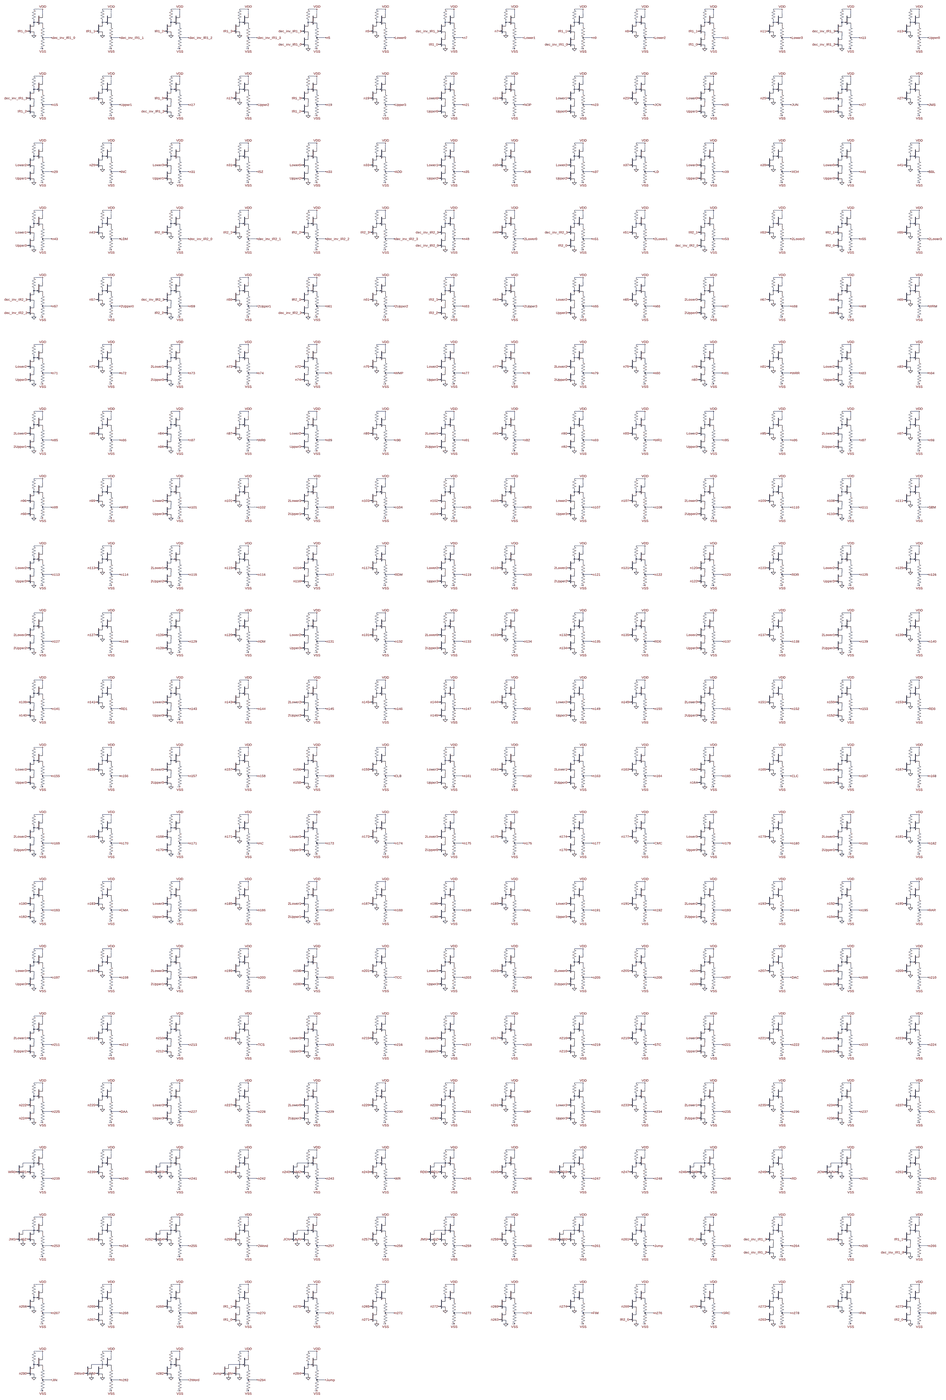
[diagram p0: schematic instruction_decoder.asc, whole sheet]
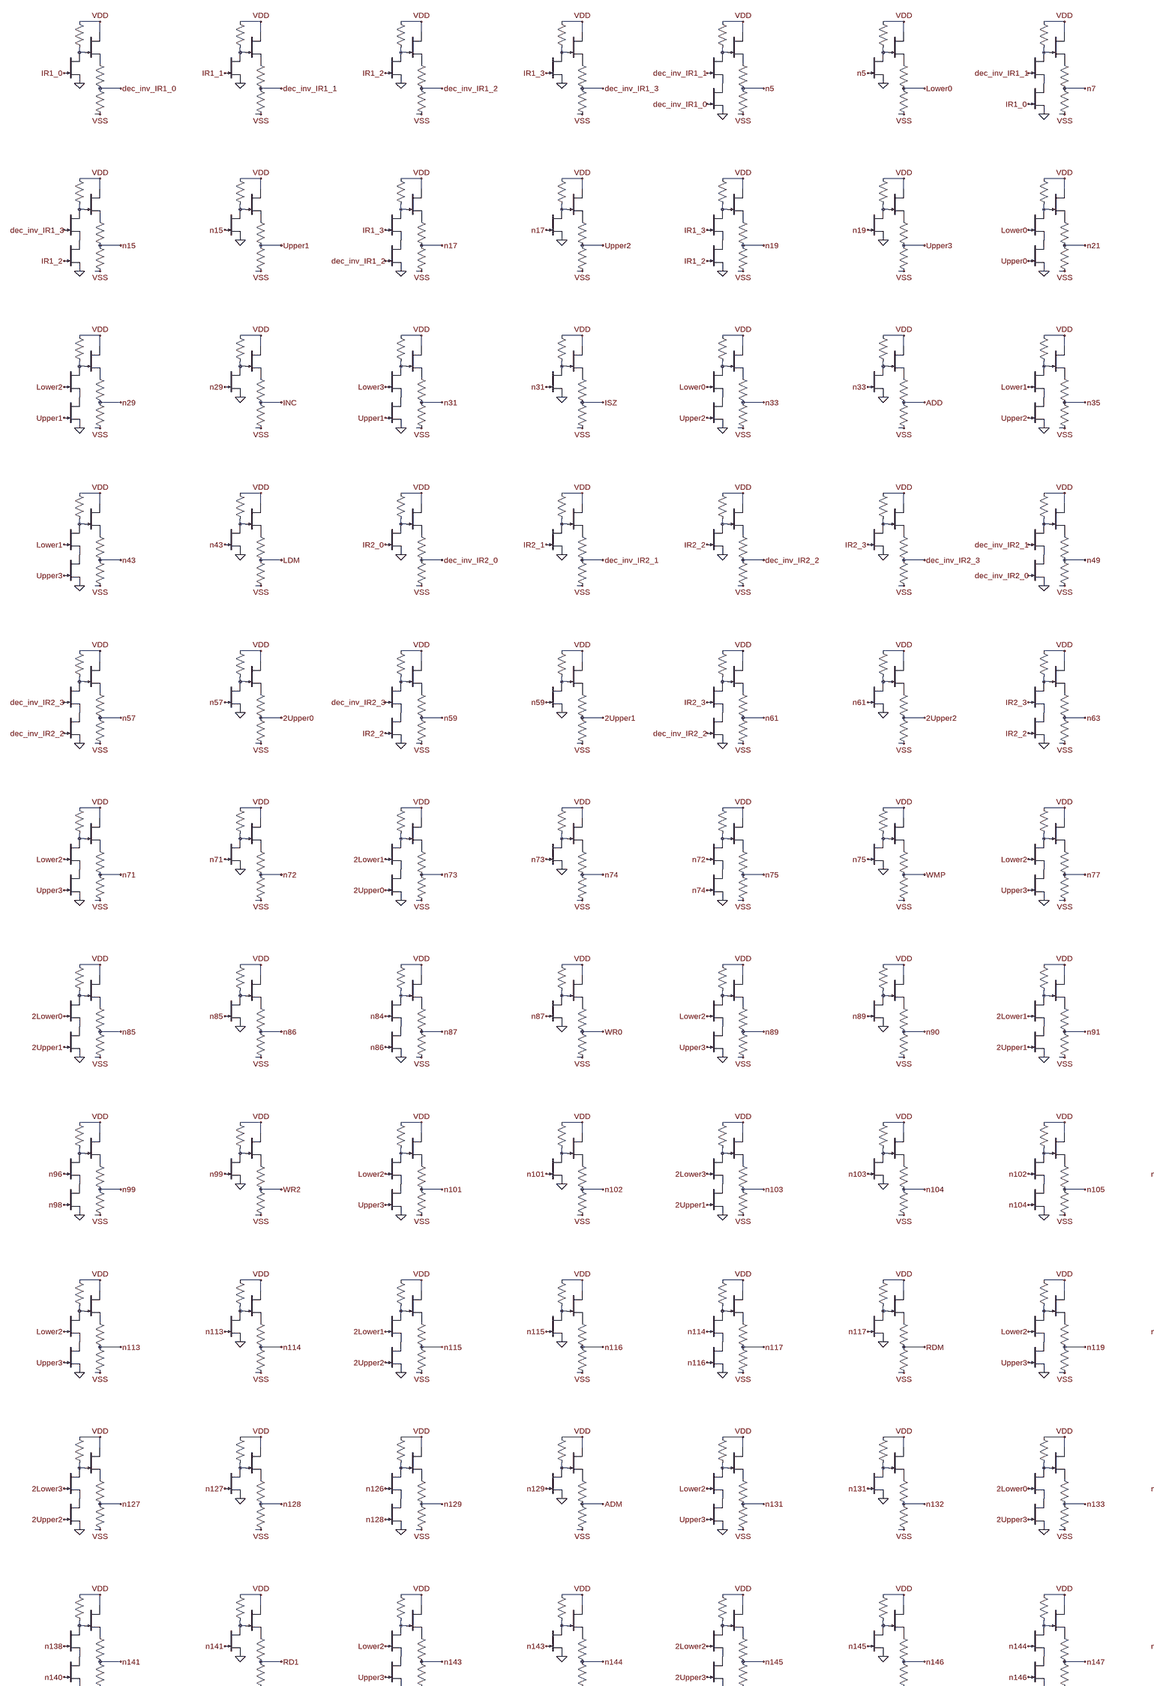
[diagram p1: schematic instruction_decoder.asc, part, row 1 of 2, column 1 of 2]
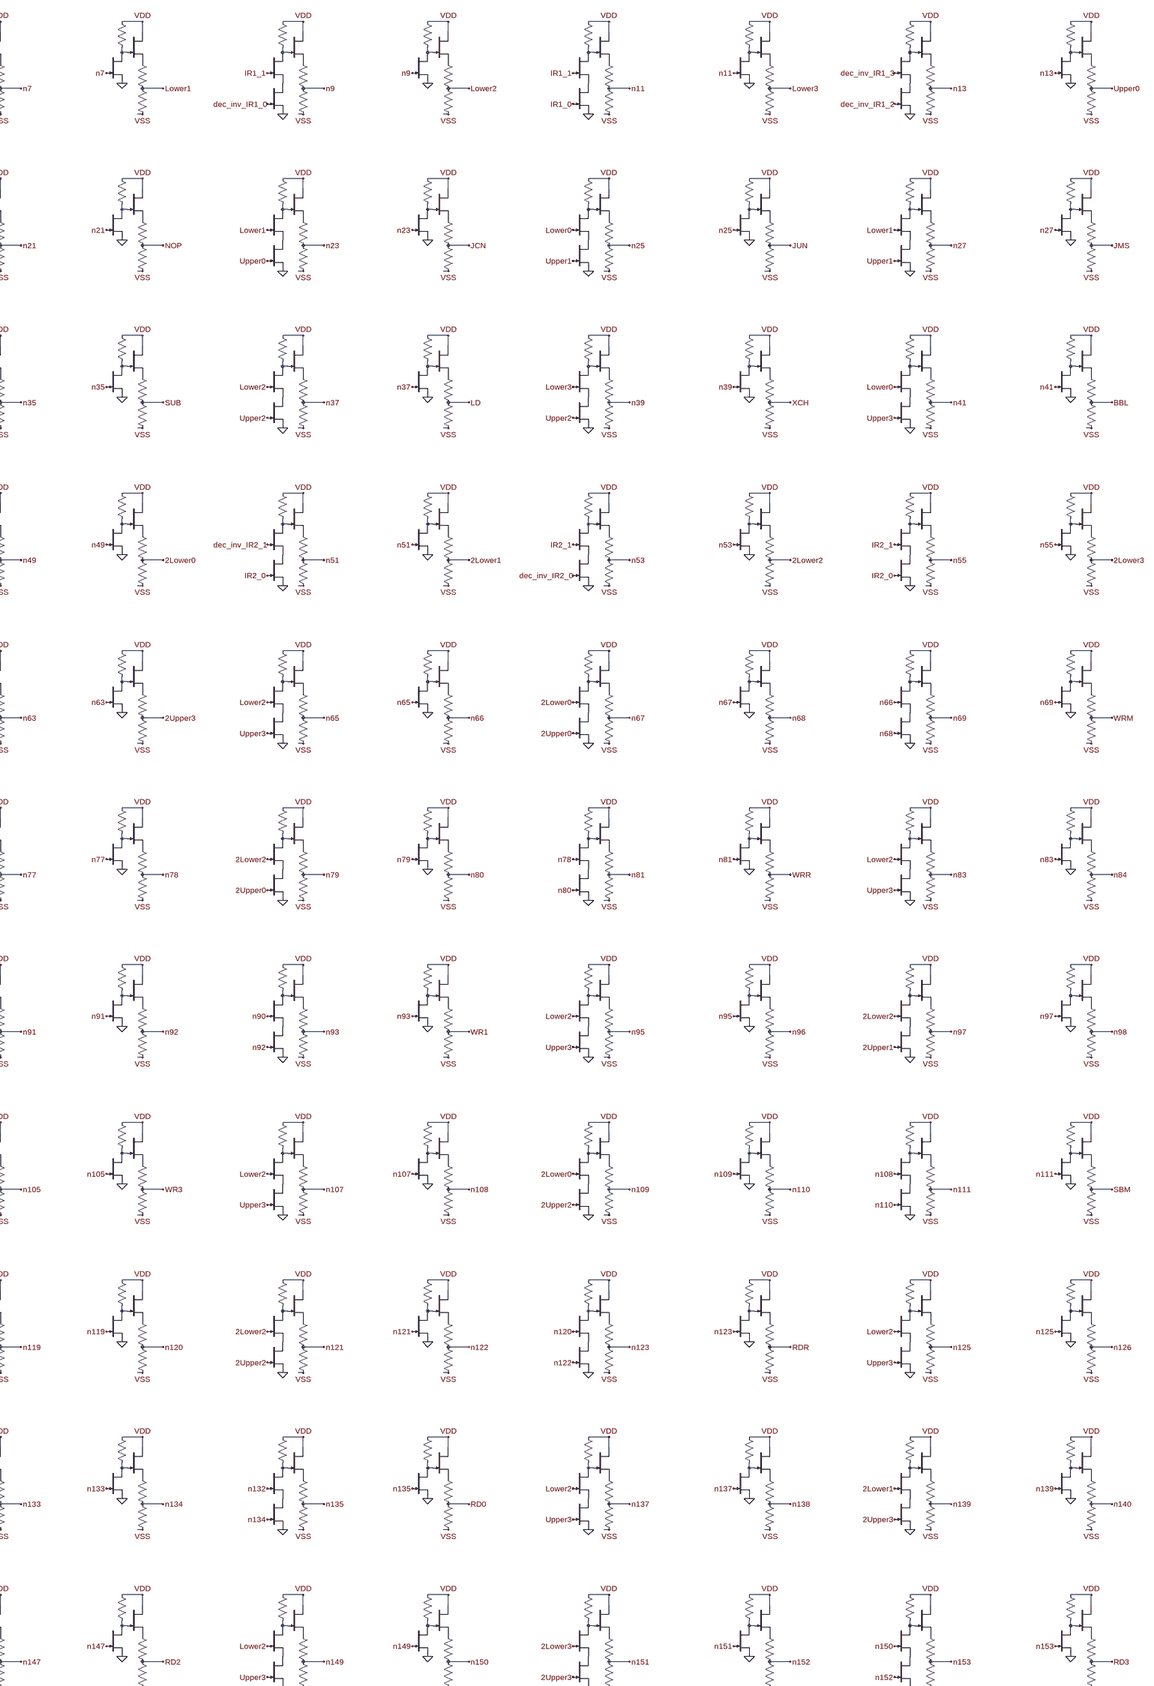
[diagram p2: schematic instruction_decoder.asc, part, row 1 of 2, column 2 of 2]
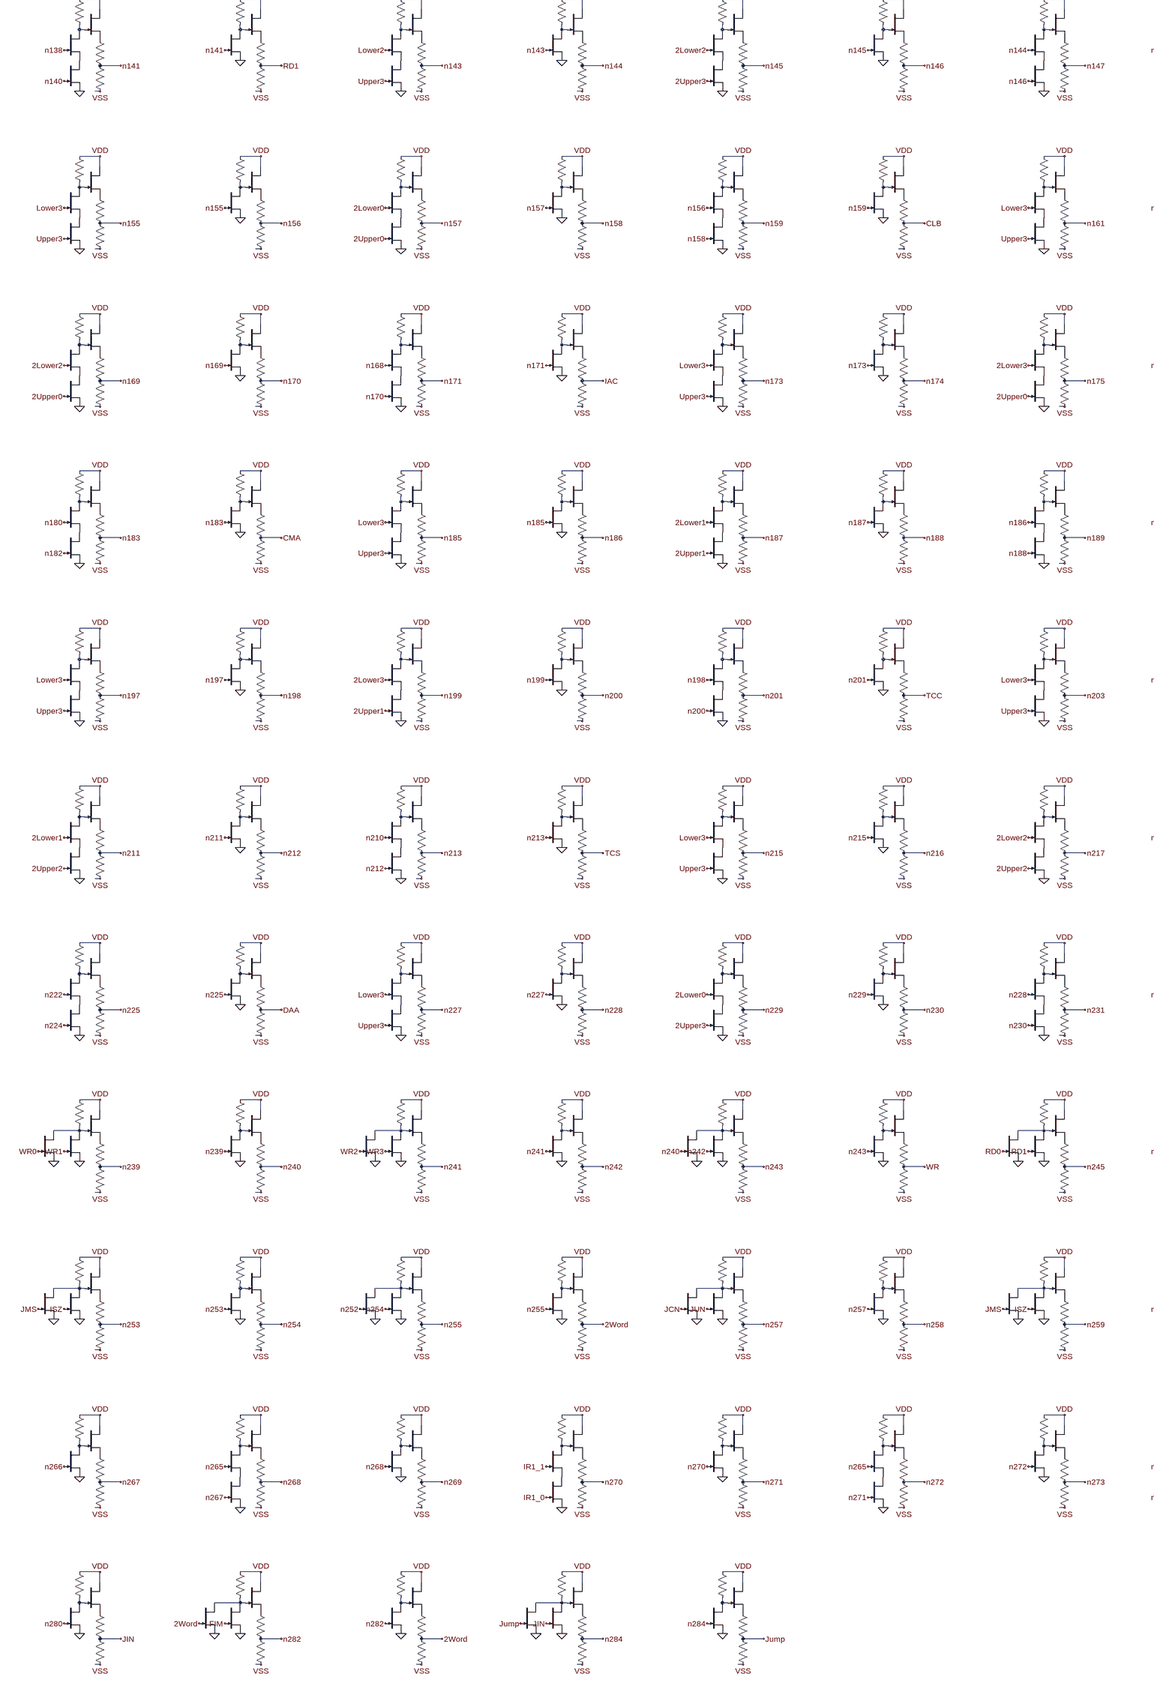
[diagram p3: schematic instruction_decoder.asc, part, row 2 of 2, column 1 of 2]
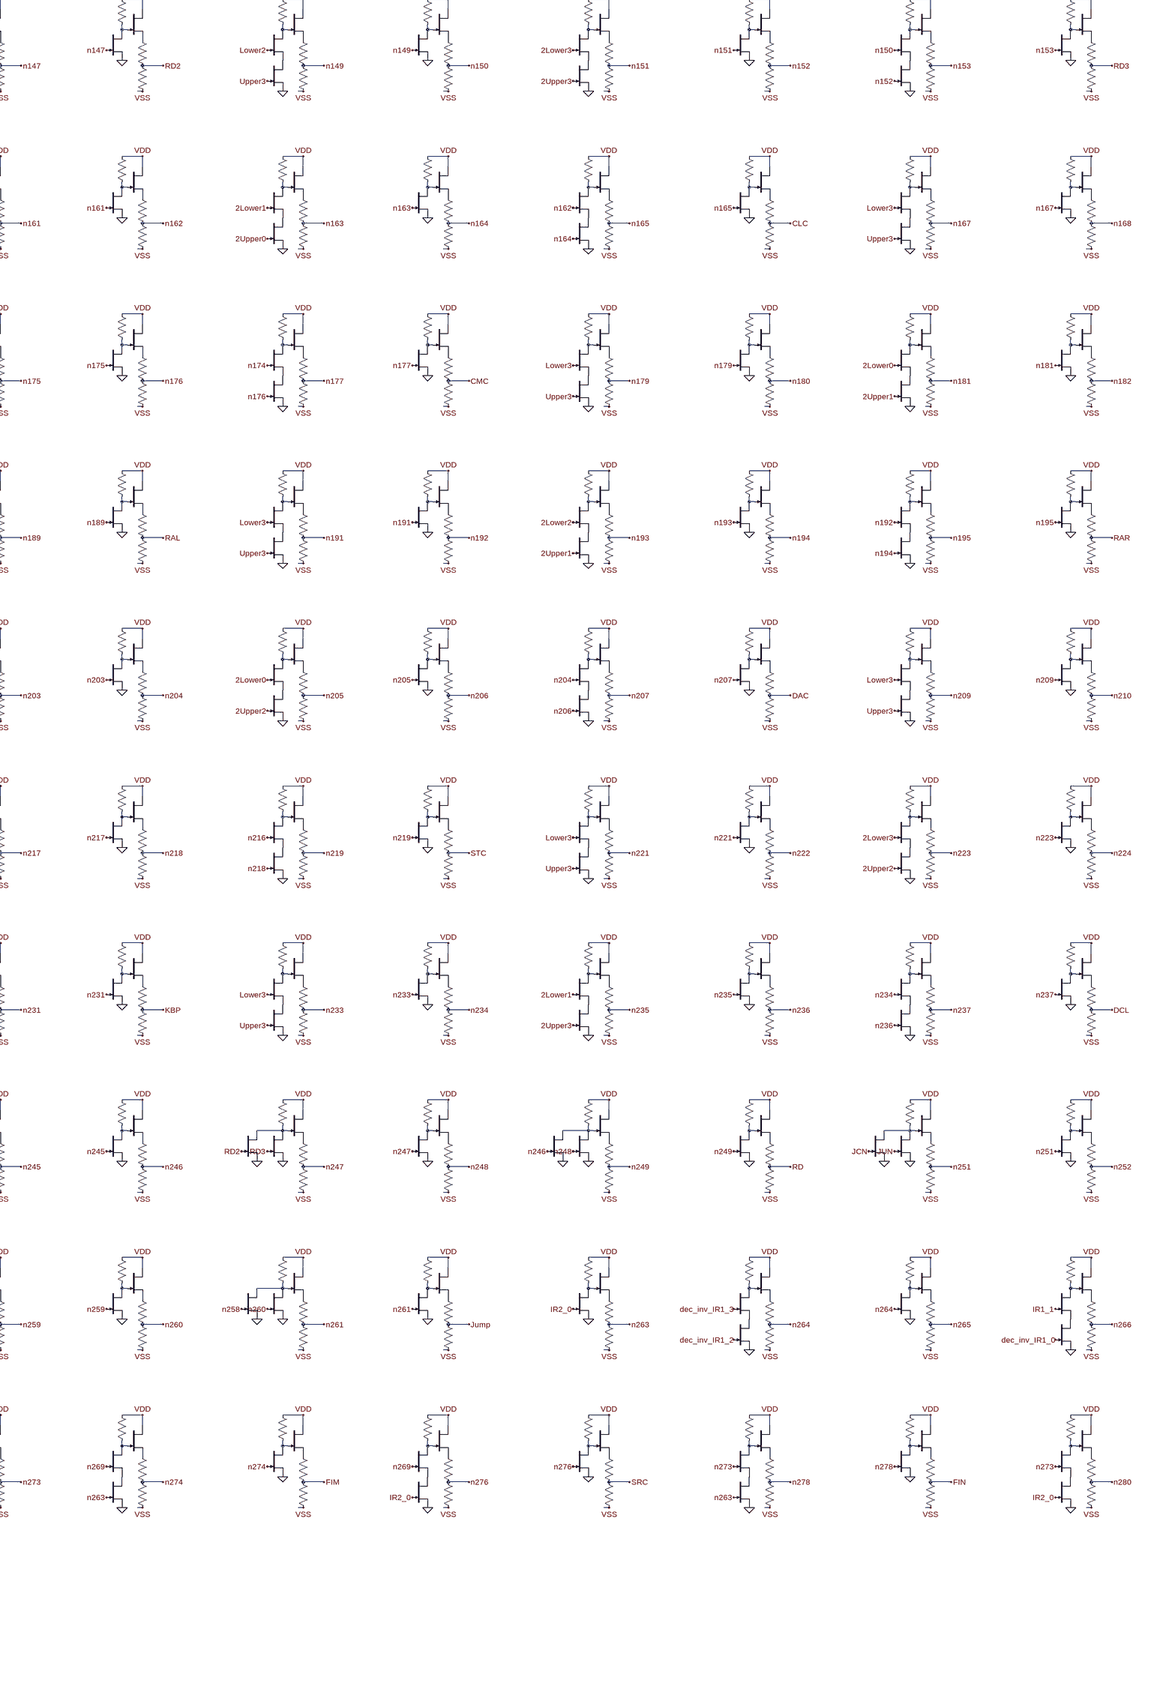
[diagram p4: schematic instruction_decoder.asc, part, row 2 of 2, column 2 of 2]
* instruction_decoder.asc
R1 VDD N001 100k
J_F1 VDD N001 P001 DR
R2 P001 dec_inv_IR1_0 1k
R3 dec_inv_IR1_0 VSS 4.8k
J_B1 N001 IR1_0 0 DR
R4 VDD N002 100k
J_F2 VDD N002 P002 DR
R5 P002 dec_inv_IR1_1 1k
R6 dec_inv_IR1_1 VSS 4.8k
J_B2 N002 IR1_1 0 DR
R7 VDD N003 100k
J_F3 VDD N003 P003 DR
R8 P003 dec_inv_IR1_2 1k
R9 dec_inv_IR1_2 VSS 4.8k
J_B3 N003 IR1_2 0 DR
R10 VDD N004 100k
J_F4 VDD N004 P004 DR
R11 P004 dec_inv_IR1_3 1k
R12 dec_inv_IR1_3 VSS 4.8k
J_B4 N004 IR1_3 0 DR
R13 VDD N005 100k
J_F5 VDD N005 P005 DR
R14 P005 n5 1k
R15 n5 VSS 4.8k
J_B5 N005 dec_inv_IR1_1 P006 DR
J_A1 P006 dec_inv_IR1_0 0 DR
R16 VDD N006 100k
J_F6 VDD N006 P007 DR
R17 P007 Lower0 1k
R18 Lower0 VSS 4.8k
J_B6 N006 n5 0 DR
R19 VDD N007 100k
J_F7 VDD N007 P008 DR
R20 P008 n7 1k
R21 n7 VSS 4.8k
J_B7 N007 dec_inv_IR1_1 P009 DR
J_A2 P009 IR1_0 0 DR
R22 VDD N008 100k
J_F8 VDD N008 P010 DR
R23 P010 Lower1 1k
R24 Lower1 VSS 4.8k
J_B8 N008 n7 0 DR
R25 VDD N009 100k
J_F9 VDD N009 P011 DR
R26 P011 n9 1k
R27 n9 VSS 4.8k
J_B9 N009 IR1_1 P012 DR
J_A3 P012 dec_inv_IR1_0 0 DR
R28 VDD N010 100k
J_F10 VDD N010 P013 DR
R29 P013 Lower2 1k
R30 Lower2 VSS 4.8k
J_B10 N010 n9 0 DR
R31 VDD N011 100k
J_F11 VDD N011 P014 DR
R32 P014 n11 1k
R33 n11 VSS 4.8k
J_B11 N011 IR1_1 P015 DR
J_A4 P015 IR1_0 0 DR
R34 VDD N012 100k
J_F12 VDD N012 P016 DR
R35 P016 Lower3 1k
R36 Lower3 VSS 4.8k
J_B12 N012 n11 0 DR
R37 VDD N013 100k
J_F13 VDD N013 P017 DR
R38 P017 n13 1k
R39 n13 VSS 4.8k
J_B13 N013 dec_inv_IR1_3 P018 DR
J_A5 P018 dec_inv_IR1_2 0 DR
R40 VDD N014 100k
J_F14 VDD N014 P019 DR
R41 P019 Upper0 1k
R42 Upper0 VSS 4.8k
J_B14 N014 n13 0 DR
R43 VDD N015 100k
J_F15 VDD N015 P020 DR
R44 P020 n15 1k
R45 n15 VSS 4.8k
J_B15 N015 dec_inv_IR1_3 P021 DR
J_A6 P021 IR1_2 0 DR
R46 VDD N016 100k
J_F16 VDD N016 P022 DR
R47 P022 Upper1 1k
R48 Upper1 VSS 4.8k
J_B16 N016 n15 0 DR
R49 VDD N017 100k
J_F17 VDD N017 P023 DR
R50 P023 n17 1k
R51 n17 VSS 4.8k
J_B17 N017 IR1_3 P024 DR
J_A7 P024 dec_inv_IR1_2 0 DR
R52 VDD N018 100k
J_F18 VDD N018 P025 DR
R53 P025 Upper2 1k
R54 Upper2 VSS 4.8k
J_B18 N018 n17 0 DR
R55 VDD N019 100k
J_F19 VDD N019 P026 DR
R56 P026 n19 1k
R57 n19 VSS 4.8k
J_B19 N019 IR1_3 P027 DR
J_A8 P027 IR1_2 0 DR
R58 VDD N020 100k
J_F20 VDD N020 P028 DR
R59 P028 Upper3 1k
R60 Upper3 VSS 4.8k
J_B20 N020 n19 0 DR
R61 VDD N021 100k
J_F21 VDD N021 P029 DR
R62 P029 n21 1k
R63 n21 VSS 4.8k
J_B21 N021 Lower0 P030 DR
J_A9 P030 Upper0 0 DR
R64 VDD N022 100k
J_F22 VDD N022 P031 DR
R65 P031 NOP 1k
R66 NOP VSS 4.8k
J_B22 N022 n21 0 DR
R67 VDD N023 100k
J_F23 VDD N023 P032 DR
R68 P032 n23 1k
R69 n23 VSS 4.8k
J_B23 N023 Lower1 P033 DR
J_A10 P033 Upper0 0 DR
R70 VDD N024 100k
J_F24 VDD N024 P034 DR
R71 P034 JCN 1k
R72 JCN VSS 4.8k
J_B24 N024 n23 0 DR
R73 VDD N025 100k
J_F25 VDD N025 P035 DR
R74 P035 n25 1k
R75 n25 VSS 4.8k
J_B25 N025 Lower0 P036 DR
J_A11 P036 Upper1 0 DR
R76 VDD N026 100k
J_F26 VDD N026 P037 DR
R77 P037 JUN 1k
R78 JUN VSS 4.8k
J_B26 N026 n25 0 DR
R79 VDD N027 100k
J_F27 VDD N027 P038 DR
R80 P038 n27 1k
R81 n27 VSS 4.8k
J_B27 N027 Lower1 P039 DR
J_A12 P039 Upper1 0 DR
R82 VDD N028 100k
J_F28 VDD N028 P040 DR
R83 P040 JMS 1k
R84 JMS VSS 4.8k
J_B28 N028 n27 0 DR
R85 VDD N029 100k
J_F29 VDD N029 P041 DR
R86 P041 n29 1k
R87 n29 VSS 4.8k
J_B29 N029 Lower2 P042 DR
J_A13 P042 Upper1 0 DR
R88 VDD N030 100k
J_F30 VDD N030 P043 DR
R89 P043 INC 1k
R90 INC VSS 4.8k
J_B30 N030 n29 0 DR
R91 VDD N031 100k
J_F31 VDD N031 P044 DR
R92 P044 n31 1k
R93 n31 VSS 4.8k
J_B31 N031 Lower3 P045 DR
J_A14 P045 Upper1 0 DR
R94 VDD N032 100k
J_F32 VDD N032 P046 DR
R95 P046 ISZ 1k
R96 ISZ VSS 4.8k
J_B32 N032 n31 0 DR
R97 VDD N033 100k
J_F33 VDD N033 P047 DR
R98 P047 n33 1k
R99 n33 VSS 4.8k
J_B33 N033 Lower0 P048 DR
J_A15 P048 Upper2 0 DR
R100 VDD N034 100k
J_F34 VDD N034 P049 DR
R101 P049 ADD 1k
R102 ADD VSS 4.8k
J_B34 N034 n33 0 DR
R103 VDD N035 100k
J_F35 VDD N035 P050 DR
R104 P050 n35 1k
R105 n35 VSS 4.8k
J_B35 N035 Lower1 P051 DR
J_A16 P051 Upper2 0 DR
R106 VDD N036 100k
J_F36 VDD N036 P052 DR
R107 P052 SUB 1k
R108 SUB VSS 4.8k
J_B36 N036 n35 0 DR
R109 VDD N037 100k
J_F37 VDD N037 P053 DR
R110 P053 n37 1k
R111 n37 VSS 4.8k
J_B37 N037 Lower2 P054 DR
J_A17 P054 Upper2 0 DR
R112 VDD N038 100k
J_F38 VDD N038 P055 DR
R113 P055 LD 1k
R114 LD VSS 4.8k
J_B38 N038 n37 0 DR
R115 VDD N039 100k
J_F39 VDD N039 P056 DR
R116 P056 n39 1k
R117 n39 VSS 4.8k
J_B39 N039 Lower3 P057 DR
J_A18 P057 Upper2 0 DR
R118 VDD N040 100k
J_F40 VDD N040 P058 DR
R119 P058 XCH 1k
R120 XCH VSS 4.8k
J_B40 N040 n39 0 DR
R121 VDD N041 100k
J_F41 VDD N041 P059 DR
R122 P059 n41 1k
R123 n41 VSS 4.8k
J_B41 N041 Lower0 P060 DR
J_A19 P060 Upper3 0 DR
R124 VDD N042 100k
J_F42 VDD N042 P061 DR
R125 P061 BBL 1k
R126 BBL VSS 4.8k
J_B42 N042 n41 0 DR
R127 VDD N043 100k
J_F43 VDD N043 P062 DR
R128 P062 n43 1k
R129 n43 VSS 4.8k
J_B43 N043 Lower1 P063 DR
J_A20 P063 Upper3 0 DR
R130 VDD N044 100k
J_F44 VDD N044 P064 DR
R131 P064 LDM 1k
R132 LDM VSS 4.8k
J_B44 N044 n43 0 DR
R133 VDD N045 100k
J_F45 VDD N045 P065 DR
R134 P065 dec_inv_IR2_0 1k
R135 dec_inv_IR2_0 VSS 4.8k
J_B45 N045 IR2_0 0 DR
R136 VDD N046 100k
J_F46 VDD N046 P066 DR
R137 P066 dec_inv_IR2_1 1k
R138 dec_inv_IR2_1 VSS 4.8k
J_B46 N046 IR2_1 0 DR
R139 VDD N047 100k
J_F47 VDD N047 P067 DR
R140 P067 dec_inv_IR2_2 1k
R141 dec_inv_IR2_2 VSS 4.8k
J_B47 N047 IR2_2 0 DR
R142 VDD N048 100k
J_F48 VDD N048 P068 DR
R143 P068 dec_inv_IR2_3 1k
R144 dec_inv_IR2_3 VSS 4.8k
J_B48 N048 IR2_3 0 DR
R145 VDD N049 100k
J_F49 VDD N049 P069 DR
R146 P069 n49 1k
R147 n49 VSS 4.8k
J_B49 N049 dec_inv_IR2_1 P070 DR
J_A21 P070 dec_inv_IR2_0 0 DR
R148 VDD N050 100k
J_F50 VDD N050 P071 DR
R149 P071 2Lower0 1k
R150 2Lower0 VSS 4.8k
J_B50 N050 n49 0 DR
R151 VDD N051 100k
J_F51 VDD N051 P072 DR
R152 P072 n51 1k
R153 n51 VSS 4.8k
J_B51 N051 dec_inv_IR2_1 P073 DR
J_A22 P073 IR2_0 0 DR
R154 VDD N052 100k
J_F52 VDD N052 P074 DR
R155 P074 2Lower1 1k
R156 2Lower1 VSS 4.8k
J_B52 N052 n51 0 DR
R157 VDD N053 100k
J_F53 VDD N053 P075 DR
R158 P075 n53 1k
R159 n53 VSS 4.8k
J_B53 N053 IR2_1 P076 DR
J_A23 P076 dec_inv_IR2_0 0 DR
R160 VDD N054 100k
J_F54 VDD N054 P077 DR
R161 P077 2Lower2 1k
R162 2Lower2 VSS 4.8k
J_B54 N054 n53 0 DR
R163 VDD N055 100k
J_F55 VDD N055 P078 DR
R164 P078 n55 1k
R165 n55 VSS 4.8k
J_B55 N055 IR2_1 P079 DR
J_A24 P079 IR2_0 0 DR
R166 VDD N056 100k
J_F56 VDD N056 P080 DR
R167 P080 2Lower3 1k
R168 2Lower3 VSS 4.8k
J_B56 N056 n55 0 DR
R169 VDD N057 100k
J_F57 VDD N057 P081 DR
R170 P081 n57 1k
R171 n57 VSS 4.8k
J_B57 N057 dec_inv_IR2_3 P082 DR
J_A25 P082 dec_inv_IR2_2 0 DR
R172 VDD N058 100k
J_F58 VDD N058 P083 DR
R173 P083 2Upper0 1k
R174 2Upper0 VSS 4.8k
J_B58 N058 n57 0 DR
R175 VDD N059 100k
J_F59 VDD N059 P084 DR
R176 P084 n59 1k
R177 n59 VSS 4.8k
J_B59 N059 dec_inv_IR2_3 P085 DR
J_A26 P085 IR2_2 0 DR
R178 VDD N060 100k
J_F60 VDD N060 P086 DR
R179 P086 2Upper1 1k
R180 2Upper1 VSS 4.8k
J_B60 N060 n59 0 DR
R181 VDD N061 100k
J_F61 VDD N061 P087 DR
R182 P087 n61 1k
R183 n61 VSS 4.8k
J_B61 N061 IR2_3 P088 DR
J_A27 P088 dec_inv_IR2_2 0 DR
R184 VDD N062 100k
J_F62 VDD N062 P089 DR
R185 P089 2Upper2 1k
R186 2Upper2 VSS 4.8k
J_B62 N062 n61 0 DR
R187 VDD N063 100k
J_F63 VDD N063 P090 DR
R188 P090 n63 1k
R189 n63 VSS 4.8k
J_B63 N063 IR2_3 P091 DR
J_A28 P091 IR2_2 0 DR
R190 VDD N064 100k
J_F64 VDD N064 P092 DR
R191 P092 2Upper3 1k
R192 2Upper3 VSS 4.8k
J_B64 N064 n63 0 DR
R193 VDD N065 100k
J_F65 VDD N065 P093 DR
R194 P093 n65 1k
R195 n65 VSS 4.8k
J_B65 N065 Lower2 P094 DR
J_A29 P094 Upper3 0 DR
R196 VDD N066 100k
J_F66 VDD N066 P095 DR
R197 P095 n66 1k
R198 n66 VSS 4.8k
J_B66 N066 n65 0 DR
R199 VDD N067 100k
J_F67 VDD N067 P096 DR
R200 P096 n67 1k
R201 n67 VSS 4.8k
J_B67 N067 2Lower0 P097 DR
J_A30 P097 2Upper0 0 DR
R202 VDD N068 100k
J_F68 VDD N068 P098 DR
R203 P098 n68 1k
R204 n68 VSS 4.8k
J_B68 N068 n67 0 DR
R205 VDD N069 100k
J_F69 VDD N069 P099 DR
R206 P099 n69 1k
R207 n69 VSS 4.8k
J_B69 N069 n66 P100 DR
J_A31 P100 n68 0 DR
R208 VDD N070 100k
J_F70 VDD N070 P101 DR
R209 P101 WRM 1k
R210 WRM VSS 4.8k
J_B70 N070 n69 0 DR
R211 VDD N071 100k
J_F71 VDD N071 P102 DR
R212 P102 n71 1k
R213 n71 VSS 4.8k
J_B71 N071 Lower2 P103 DR
J_A32 P103 Upper3 0 DR
R214 VDD N072 100k
J_F72 VDD N072 P104 DR
R215 P104 n72 1k
R216 n72 VSS 4.8k
J_B72 N072 n71 0 DR
R217 VDD N073 100k
J_F73 VDD N073 P105 DR
R218 P105 n73 1k
R219 n73 VSS 4.8k
J_B73 N073 2Lower1 P106 DR
J_A33 P106 2Upper0 0 DR
R220 VDD N074 100k
J_F74 VDD N074 P107 DR
R221 P107 n74 1k
R222 n74 VSS 4.8k
J_B74 N074 n73 0 DR
R223 VDD N075 100k
J_F75 VDD N075 P108 DR
R224 P108 n75 1k
R225 n75 VSS 4.8k
J_B75 N075 n72 P109 DR
J_A34 P109 n74 0 DR
R226 VDD N076 100k
J_F76 VDD N076 P110 DR
R227 P110 WMP 1k
R228 WMP VSS 4.8k
J_B76 N076 n75 0 DR
R229 VDD N077 100k
J_F77 VDD N077 P111 DR
R230 P111 n77 1k
R231 n77 VSS 4.8k
J_B77 N077 Lower2 P112 DR
J_A35 P112 Upper3 0 DR
R232 VDD N078 100k
J_F78 VDD N078 P113 DR
R233 P113 n78 1k
R234 n78 VSS 4.8k
J_B78 N078 n77 0 DR
R235 VDD N079 100k
J_F79 VDD N079 P114 DR
R236 P114 n79 1k
R237 n79 VSS 4.8k
J_B79 N079 2Lower2 P115 DR
J_A36 P115 2Upper0 0 DR
R238 VDD N080 100k
J_F80 VDD N080 P116 DR
R239 P116 n80 1k
R240 n80 VSS 4.8k
J_B80 N080 n79 0 DR
R241 VDD N081 100k
J_F81 VDD N081 P117 DR
R242 P117 n81 1k
R243 n81 VSS 4.8k
J_B81 N081 n78 P118 DR
J_A37 P118 n80 0 DR
R244 VDD N082 100k
J_F82 VDD N082 P119 DR
R245 P119 WRR 1k
R246 WRR VSS 4.8k
J_B82 N082 n81 0 DR
R247 VDD N083 100k
J_F83 VDD N083 P120 DR
R248 P120 n83 1k
R249 n83 VSS 4.8k
J_B83 N083 Lower2 P121 DR
J_A38 P121 Upper3 0 DR
R250 VDD N084 100k
J_F84 VDD N084 P122 DR
R251 P122 n84 1k
R252 n84 VSS 4.8k
J_B84 N084 n83 0 DR
R253 VDD N085 100k
J_F85 VDD N085 P123 DR
R254 P123 n85 1k
R255 n85 VSS 4.8k
J_B85 N085 2Lower0 P124 DR
J_A39 P124 2Upper1 0 DR
R256 VDD N086 100k
J_F86 VDD N086 P125 DR
R257 P125 n86 1k
R258 n86 VSS 4.8k
J_B86 N086 n85 0 DR
R259 VDD N087 100k
J_F87 VDD N087 P126 DR
R260 P126 n87 1k
R261 n87 VSS 4.8k
J_B87 N087 n84 P127 DR
J_A40 P127 n86 0 DR
R262 VDD N088 100k
J_F88 VDD N088 P128 DR
R263 P128 WR0 1k
R264 WR0 VSS 4.8k
J_B88 N088 n87 0 DR
R265 VDD N089 100k
J_F89 VDD N089 P129 DR
R266 P129 n89 1k
R267 n89 VSS 4.8k
J_B89 N089 Lower2 P130 DR
J_A41 P130 Upper3 0 DR
R268 VDD N090 100k
J_F90 VDD N090 P131 DR
R269 P131 n90 1k
R270 n90 VSS 4.8k
J_B90 N090 n89 0 DR
R271 VDD N091 100k
J_F91 VDD N091 P132 DR
R272 P132 n91 1k
R273 n91 VSS 4.8k
J_B91 N091 2Lower1 P133 DR
J_A42 P133 2Upper1 0 DR
R274 VDD N092 100k
J_F92 VDD N092 P134 DR
R275 P134 n92 1k
R276 n92 VSS 4.8k
J_B92 N092 n91 0 DR
R277 VDD N093 100k
J_F93 VDD N093 P135 DR
R278 P135 n93 1k
R279 n93 VSS 4.8k
J_B93 N093 n90 P136 DR
J_A43 P136 n92 0 DR
R280 VDD N094 100k
J_F94 VDD N094 P137 DR
R281 P137 WR1 1k
R282 WR1 VSS 4.8k
J_B94 N094 n93 0 DR
R283 VDD N095 100k
J_F95 VDD N095 P138 DR
R284 P138 n95 1k
R285 n95 VSS 4.8k
J_B95 N095 Lower2 P139 DR
J_A44 P139 Upper3 0 DR
R286 VDD N096 100k
J_F96 VDD N096 P140 DR
R287 P140 n96 1k
R288 n96 VSS 4.8k
J_B96 N096 n95 0 DR
R289 VDD N097 100k
J_F97 VDD N097 P141 DR
R290 P141 n97 1k
R291 n97 VSS 4.8k
J_B97 N097 2Lower2 P142 DR
J_A45 P142 2Upper1 0 DR
R292 VDD N098 100k
J_F98 VDD N098 P143 DR
R293 P143 n98 1k
R294 n98 VSS 4.8k
J_B98 N098 n97 0 DR
R295 VDD N099 100k
J_F99 VDD N099 P144 DR
R296 P144 n99 1k
R297 n99 VSS 4.8k
J_B99 N099 n96 P145 DR
J_A46 P145 n98 0 DR
R298 VDD N100 100k
J_F100 VDD N100 P146 DR
R299 P146 WR2 1k
R300 WR2 VSS 4.8k
J_B100 N100 n99 0 DR
R301 VDD N106 100k
J_F101 VDD N106 P147 DR
R302 P147 n101 1k
R303 n101 VSS 4.8k
J_B101 N106 Lower2 P148 DR
J_A47 P148 Upper3 0 DR
R304 VDD N112 100k
J_F102 VDD N112 P149 DR
R305 P149 n102 1k
R306 n102 VSS 4.8k
J_B102 N112 n101 0 DR
R307 VDD N118 100k
J_F103 VDD N118 P150 DR
R308 P150 n103 1k
R309 n103 VSS 4.8k
J_B103 N118 2Lower3 P151 DR
J_A48 P151 2Upper1 0 DR
R310 VDD N124 100k
J_F104 VDD N124 P152 DR
R311 P152 n104 1k
R312 n104 VSS 4.8k
J_B104 N124 n103 0 DR
R313 VDD N130 100k
J_F105 VDD N130 P153 DR
R314 P153 n105 1k
R315 n105 VSS 4.8k
J_B105 N130 n102 P154 DR
J_A49 P154 n104 0 DR
R316 VDD N136 100k
J_F106 VDD N136 P155 DR
R317 P155 WR3 1k
R318 WR3 VSS 4.8k
J_B106 N136 n105 0 DR
R319 VDD N142 100k
J_F107 VDD N142 P156 DR
R320 P156 n107 1k
R321 n107 VSS 4.8k
J_B107 N142 Lower2 P157 DR
J_A50 P157 Upper3 0 DR
R322 VDD N148 100k
J_F108 VDD N148 P158 DR
R323 P158 n108 1k
R324 n108 VSS 4.8k
J_B108 N148 n107 0 DR
R325 VDD N154 100k
J_F109 VDD N154 P159 DR
R326 P159 n109 1k
R327 n109 VSS 4.8k
J_B109 N154 2Lower0 P160 DR
J_A51 P160 2Upper2 0 DR
R328 VDD N160 100k
J_F110 VDD N160 P161 DR
R329 P161 n110 1k
R330 n110 VSS 4.8k
J_B110 N160 n109 0 DR
R331 VDD N166 100k
J_F111 VDD N166 P162 DR
R332 P162 n111 1k
R333 n111 VSS 4.8k
J_B111 N166 n108 P163 DR
J_A52 P163 n110 0 DR
R334 VDD N172 100k
J_F112 VDD N172 P164 DR
R335 P164 SBM 1k
R336 SBM VSS 4.8k
J_B112 N172 n111 0 DR
R337 VDD N178 100k
J_F113 VDD N178 P165 DR
R338 P165 n113 1k
R339 n113 VSS 4.8k
J_B113 N178 Lower2 P166 DR
J_A53 P166 Upper3 0 DR
R340 VDD N184 100k
J_F114 VDD N184 P167 DR
R341 P167 n114 1k
R342 n114 VSS 4.8k
J_B114 N184 n113 0 DR
R343 VDD N190 100k
J_F115 VDD N190 P168 DR
R344 P168 n115 1k
R345 n115 VSS 4.8k
J_B115 N190 2Lower1 P169 DR
J_A54 P169 2Upper2 0 DR
R346 VDD N196 100k
J_F116 VDD N196 P170 DR
R347 P170 n116 1k
R348 n116 VSS 4.8k
J_B116 N196 n115 0 DR
R349 VDD N202 100k
J_F117 VDD N202 P171 DR
R350 P171 n117 1k
R351 n117 VSS 4.8k
J_B117 N202 n114 P172 DR
J_A55 P172 n116 0 DR
R352 VDD N208 100k
J_F118 VDD N208 P173 DR
R353 P173 RDM 1k
R354 RDM VSS 4.8k
J_B118 N208 n117 0 DR
R355 VDD N214 100k
J_F119 VDD N214 P174 DR
R356 P174 n119 1k
R357 n119 VSS 4.8k
J_B119 N214 Lower2 P175 DR
J_A56 P175 Upper3 0 DR
R358 VDD N220 100k
J_F120 VDD N220 P176 DR
R359 P176 n120 1k
R360 n120 VSS 4.8k
J_B120 N220 n119 0 DR
R361 VDD N226 100k
J_F121 VDD N226 P177 DR
R362 P177 n121 1k
R363 n121 VSS 4.8k
J_B121 N226 2Lower2 P178 DR
J_A57 P178 2Upper2 0 DR
R364 VDD N232 100k
J_F122 VDD N232 P179 DR
R365 P179 n122 1k
R366 n122 VSS 4.8k
J_B122 N232 n121 0 DR
R367 VDD N238 100k
J_F123 VDD N238 P180 DR
R368 P180 n123 1k
R369 n123 VSS 4.8k
J_B123 N238 n120 P181 DR
J_A58 P181 n122 0 DR
R370 VDD N244 100k
J_F124 VDD N244 P182 DR
R371 P182 RDR 1k
R372 RDR VSS 4.8k
J_B124 N244 n123 0 DR
R373 VDD N250 100k
J_F125 VDD N250 P183 DR
R374 P183 n125 1k
R375 n125 VSS 4.8k
J_B125 N250 Lower2 P184 DR
J_A59 P184 Upper3 0 DR
R376 VDD N256 100k
J_F126 VDD N256 P185 DR
R377 P185 n126 1k
R378 n126 VSS 4.8k
J_B126 N256 n125 0 DR
R379 VDD N262 100k
J_F127 VDD N262 P186 DR
R380 P186 n127 1k
R381 n127 VSS 4.8k
J_B127 N262 2Lower3 P187 DR
J_A60 P187 2Upper2 0 DR
R382 VDD N275 100k
J_F128 VDD N275 P188 DR
R383 P188 n128 1k
R384 n128 VSS 4.8k
J_B128 N275 n127 0 DR
R385 VDD N277 100k
J_F129 VDD N277 P189 DR
R386 P189 n129 1k
R387 n129 VSS 4.8k
J_B129 N277 n126 P190 DR
J_A61 P190 n128 0 DR
R388 VDD N279 100k
J_F130 VDD N279 P191 DR
R389 P191 ADM 1k
R390 ADM VSS 4.8k
J_B130 N279 n129 0 DR
R391 VDD N281 100k
J_F131 VDD N281 P192 DR
R392 P192 n131 1k
R393 n131 VSS 4.8k
J_B131 N281 Lower2 P193 DR
J_A62 P193 Upper3 0 DR
R394 VDD N283 100k
J_F132 VDD N283 P194 DR
R395 P194 n132 1k
R396 n132 VSS 4.8k
J_B132 N283 n131 0 DR
R397 VDD N285 100k
J_F133 VDD N285 P195 DR
R398 P195 n133 1k
R399 n133 VSS 4.8k
J_B133 N285 2Lower0 P196 DR
J_A63 P196 2Upper3 0 DR
R400 VDD N286 100k
J_F134 VDD N286 P197 DR
R401 P197 n134 1k
R402 n134 VSS 4.8k
J_B134 N286 n133 0 DR
R403 VDD N287 100k
J_F135 VDD N287 P198 DR
R404 P198 n135 1k
R405 n135 VSS 4.8k
J_B135 N287 n132 P199 DR
J_A64 P199 n134 0 DR
R406 VDD N288 100k
J_F136 VDD N288 P200 DR
R407 P200 RD0 1k
R408 RD0 VSS 4.8k
J_B136 N288 n135 0 DR
R409 VDD N289 100k
J_F137 VDD N289 P201 DR
R410 P201 n137 1k
R411 n137 VSS 4.8k
J_B137 N289 Lower2 P202 DR
J_A65 P202 Upper3 0 DR
R412 VDD N290 100k
J_F138 VDD N290 P203 DR
R413 P203 n138 1k
R414 n138 VSS 4.8k
J_B138 N290 n137 0 DR
R415 VDD N291 100k
J_F139 VDD N291 P204 DR
R416 P204 n139 1k
R417 n139 VSS 4.8k
J_B139 N291 2Lower1 P205 DR
J_A66 P205 2Upper3 0 DR
R418 VDD N292 100k
J_F140 VDD N292 P206 DR
R419 P206 n140 1k
R420 n140 VSS 4.8k
J_B140 N292 n139 0 DR
R421 VDD N293 100k
J_F141 VDD N293 P207 DR
R422 P207 n141 1k
R423 n141 VSS 4.8k
J_B141 N293 n138 P208 DR
J_A67 P208 n140 0 DR
R424 VDD N294 100k
J_F142 VDD N294 P209 DR
R425 P209 RD1 1k
R426 RD1 VSS 4.8k
J_B142 N294 n141 0 DR
R427 VDD N295 100k
J_F143 VDD N295 P210 DR
R428 P210 n143 1k
R429 n143 VSS 4.8k
J_B143 N295 Lower2 P211 DR
J_A68 P211 Upper3 0 DR
R430 VDD N296 100k
J_F144 VDD N296 P212 DR
R431 P212 n144 1k
R432 n144 VSS 4.8k
J_B144 N296 n143 0 DR
R433 VDD N297 100k
J_F145 VDD N297 P213 DR
R434 P213 n145 1k
R435 n145 VSS 4.8k
J_B145 N297 2Lower2 P214 DR
J_A69 P214 2Upper3 0 DR
R436 VDD N298 100k
J_F146 VDD N298 P215 DR
R437 P215 n146 1k
R438 n146 VSS 4.8k
J_B146 N298 n145 0 DR
R439 VDD N299 100k
J_F147 VDD N299 P216 DR
R440 P216 n147 1k
R441 n147 VSS 4.8k
J_B147 N299 n144 P217 DR
J_A70 P217 n146 0 DR
R442 VDD N300 100k
J_F148 VDD N300 P218 DR
R443 P218 RD2 1k
R444 RD2 VSS 4.8k
J_B148 N300 n147 0 DR
R445 VDD N301 100k
J_F149 VDD N301 P219 DR
R446 P219 n149 1k
R447 n149 VSS 4.8k
J_B149 N301 Lower2 P220 DR
J_A71 P220 Upper3 0 DR
R448 VDD N302 100k
J_F150 VDD N302 P221 DR
R449 P221 n150 1k
R450 n150 VSS 4.8k
J_B150 N302 n149 0 DR
R451 VDD N303 100k
J_F151 VDD N303 P222 DR
R452 P222 n151 1k
R453 n151 VSS 4.8k
J_B151 N303 2Lower3 P223 DR
J_A72 P223 2Upper3 0 DR
R454 VDD N304 100k
J_F152 VDD N304 P224 DR
R455 P224 n152 1k
R456 n152 VSS 4.8k
J_B152 N304 n151 0 DR
R457 VDD N305 100k
J_F153 VDD N305 P225 DR
R458 P225 n153 1k
R459 n153 VSS 4.8k
J_B153 N305 n150 P226 DR
J_A73 P226 n152 0 DR
R460 VDD N306 100k
J_F154 VDD N306 P227 DR
R461 P227 RD3 1k
R462 RD3 VSS 4.8k
J_B154 N306 n153 0 DR
R463 VDD N307 100k
J_F155 VDD N307 P228 DR
R464 P228 n155 1k
R465 n155 VSS 4.8k
J_B155 N307 Lower3 P229 DR
J_A74 P229 Upper3 0 DR
R466 VDD N308 100k
J_F156 VDD N308 P230 DR
R467 P230 n156 1k
R468 n156 VSS 4.8k
J_B156 N308 n155 0 DR
R469 VDD N309 100k
J_F157 VDD N309 P231 DR
R470 P231 n157 1k
R471 n157 VSS 4.8k
J_B157 N309 2Lower0 P232 DR
J_A75 P232 2Upper0 0 DR
R472 VDD N310 100k
J_F158 VDD N310 P233 DR
R473 P233 n158 1k
R474 n158 VSS 4.8k
J_B158 N310 n157 0 DR
R475 VDD N311 100k
J_F159 VDD N311 P234 DR
R476 P234 n159 1k
R477 n159 VSS 4.8k
J_B159 N311 n156 P235 DR
J_A76 P235 n158 0 DR
R478 VDD N312 100k
J_F160 VDD N312 P236 DR
R479 P236 CLB 1k
R480 CLB VSS 4.8k
J_B160 N312 n159 0 DR
R481 VDD N313 100k
J_F161 VDD N313 P237 DR
R482 P237 n161 1k
R483 n161 VSS 4.8k
J_B161 N313 Lower3 P238 DR
J_A77 P238 Upper3 0 DR
R484 VDD N314 100k
J_F162 VDD N314 P239 DR
R485 P239 n162 1k
R486 n162 VSS 4.8k
J_B162 N314 n161 0 DR
R487 VDD N315 100k
J_F163 VDD N315 P240 DR
R488 P240 n163 1k
R489 n163 VSS 4.8k
J_B163 N315 2Lower1 P241 DR
J_A78 P241 2Upper0 0 DR
R490 VDD N316 100k
J_F164 VDD N316 P242 DR
R491 P242 n164 1k
R492 n164 VSS 4.8k
J_B164 N316 n163 0 DR
R493 VDD N317 100k
J_F165 VDD N317 P243 DR
R494 P243 n165 1k
R495 n165 VSS 4.8k
J_B165 N317 n162 P244 DR
J_A79 P244 n164 0 DR
R496 VDD N318 100k
J_F166 VDD N318 P245 DR
R497 P245 CLC 1k
R498 CLC VSS 4.8k
J_B166 N318 n165 0 DR
R499 VDD N319 100k
J_F167 VDD N319 P246 DR
R500 P246 n167 1k
R501 n167 VSS 4.8k
J_B167 N319 Lower3 P247 DR
J_A80 P247 Upper3 0 DR
R502 VDD N320 100k
J_F168 VDD N320 P248 DR
R503 P248 n168 1k
R504 n168 VSS 4.8k
J_B168 N320 n167 0 DR
R505 VDD N321 100k
J_F169 VDD N321 P249 DR
R506 P249 n169 1k
R507 n169 VSS 4.8k
J_B169 N321 2Lower2 P250 DR
J_A81 P250 2Upper0 0 DR
R508 VDD N322 100k
J_F170 VDD N322 P251 DR
R509 P251 n170 1k
R510 n170 VSS 4.8k
J_B170 N322 n169 0 DR
R511 VDD N323 100k
J_F171 VDD N323 P252 DR
R512 P252 n171 1k
R513 n171 VSS 4.8k
J_B171 N323 n168 P253 DR
J_A82 P253 n170 0 DR
R514 VDD N324 100k
J_F172 VDD N324 P254 DR
R515 P254 IAC 1k
R516 IAC VSS 4.8k
J_B172 N324 n171 0 DR
R517 VDD N325 100k
J_F173 VDD N325 P255 DR
R518 P255 n173 1k
R519 n173 VSS 4.8k
J_B173 N325 Lower3 P256 DR
J_A83 P256 Upper3 0 DR
R520 VDD N326 100k
J_F174 VDD N326 P257 DR
R521 P257 n174 1k
R522 n174 VSS 4.8k
J_B174 N326 n173 0 DR
R523 VDD N327 100k
J_F175 VDD N327 P258 DR
R524 P258 n175 1k
R525 n175 VSS 4.8k
J_B175 N327 2Lower3 P259 DR
J_A84 P259 2Upper0 0 DR
R526 VDD N328 100k
J_F176 VDD N328 P260 DR
R527 P260 n176 1k
R528 n176 VSS 4.8k
J_B176 N328 n175 0 DR
R529 VDD N329 100k
J_F177 VDD N329 P261 DR
R530 P261 n177 1k
R531 n177 VSS 4.8k
J_B177 N329 n174 P262 DR
J_A85 P262 n176 0 DR
R532 VDD N330 100k
J_F178 VDD N330 P263 DR
R533 P263 CMC 1k
R534 CMC VSS 4.8k
J_B178 N330 n177 0 DR
R535 VDD N331 100k
J_F179 VDD N331 P264 DR
R536 P264 n179 1k
R537 n179 VSS 4.8k
J_B179 N331 Lower3 P265 DR
J_A86 P265 Upper3 0 DR
R538 VDD N332 100k
J_F180 VDD N332 P266 DR
R539 P266 n180 1k
R540 n180 VSS 4.8k
J_B180 N332 n179 0 DR
R541 VDD N333 100k
J_F181 VDD N333 P267 DR
R542 P267 n181 1k
R543 n181 VSS 4.8k
J_B181 N333 2Lower0 P268 DR
J_A87 P268 2Upper1 0 DR
R544 VDD N334 100k
J_F182 VDD N334 P269 DR
R545 P269 n182 1k
R546 n182 VSS 4.8k
J_B182 N334 n181 0 DR
R547 VDD N335 100k
J_F183 VDD N335 P270 DR
R548 P270 n183 1k
R549 n183 VSS 4.8k
J_B183 N335 n180 P271 DR
J_A88 P271 n182 0 DR
R550 VDD N336 100k
J_F184 VDD N336 P272 DR
R551 P272 CMA 1k
R552 CMA VSS 4.8k
J_B184 N336 n183 0 DR
R553 VDD N337 100k
J_F185 VDD N337 P273 DR
R554 P273 n185 1k
R555 n185 VSS 4.8k
J_B185 N337 Lower3 P274 DR
J_A89 P274 Upper3 0 DR
R556 VDD N338 100k
J_F186 VDD N338 P275 DR
R557 P275 n186 1k
R558 n186 VSS 4.8k
J_B186 N338 n185 0 DR
R559 VDD N339 100k
J_F187 VDD N339 P276 DR
R560 P276 n187 1k
R561 n187 VSS 4.8k
J_B187 N339 2Lower1 P277 DR
J_A90 P277 2Upper1 0 DR
R562 VDD N340 100k
J_F188 VDD N340 P278 DR
R563 P278 n188 1k
R564 n188 VSS 4.8k
J_B188 N340 n187 0 DR
R565 VDD N341 100k
J_F189 VDD N341 P279 DR
R566 P279 n189 1k
R567 n189 VSS 4.8k
J_B189 N341 n186 P280 DR
J_A91 P280 n188 0 DR
R568 VDD N342 100k
J_F190 VDD N342 P281 DR
R569 P281 RAL 1k
R570 RAL VSS 4.8k
J_B190 N342 n189 0 DR
R571 VDD N343 100k
J_F191 VDD N343 P282 DR
R572 P282 n191 1k
R573 n191 VSS 4.8k
J_B191 N343 Lower3 P283 DR
J_A92 P283 Upper3 0 DR
R574 VDD N344 100k
J_F192 VDD N344 P284 DR
R575 P284 n192 1k
R576 n192 VSS 4.8k
J_B192 N344 n191 0 DR
R577 VDD N345 100k
J_F193 VDD N345 P285 DR
R578 P285 n193 1k
R579 n193 VSS 4.8k
J_B193 N345 2Lower2 P286 DR
J_A93 P286 2Upper1 0 DR
R580 VDD N346 100k
J_F194 VDD N346 P287 DR
R581 P287 n194 1k
R582 n194 VSS 4.8k
J_B194 N346 n193 0 DR
R583 VDD N347 100k
J_F195 VDD N347 P288 DR
R584 P288 n195 1k
R585 n195 VSS 4.8k
J_B195 N347 n192 P289 DR
J_A94 P289 n194 0 DR
R586 VDD N348 100k
J_F196 VDD N348 P290 DR
R587 P290 RAR 1k
R588 RAR VSS 4.8k
J_B196 N348 n195 0 DR
R589 VDD N349 100k
J_F197 VDD N349 P291 DR
R590 P291 n197 1k
R591 n197 VSS 4.8k
J_B197 N349 Lower3 P292 DR
J_A95 P292 Upper3 0 DR
R592 VDD N350 100k
J_F198 VDD N350 P293 DR
R593 P293 n198 1k
R594 n198 VSS 4.8k
J_B198 N350 n197 0 DR
R595 VDD N351 100k
J_F199 VDD N351 P294 DR
R596 P294 n199 1k
R597 n199 VSS 4.8k
J_B199 N351 2Lower3 P295 DR
J_A96 P295 2Upper1 0 DR
R598 VDD N352 100k
J_F200 VDD N352 P296 DR
R599 P296 n200 1k
R600 n200 VSS 4.8k
J_B200 N352 n199 0 DR
R601 VDD N353 100k
J_F201 VDD N353 P297 DR
R602 P297 n201 1k
R603 n201 VSS 4.8k
J_B201 N353 n198 P298 DR
J_A97 P298 n200 0 DR
R604 VDD N354 100k
J_F202 VDD N354 P299 DR
R605 P299 TCC 1k
R606 TCC VSS 4.8k
J_B202 N354 n201 0 DR
R607 VDD N355 100k
J_F203 VDD N355 P300 DR
R608 P300 n203 1k
R609 n203 VSS 4.8k
J_B203 N355 Lower3 P301 DR
J_A98 P301 Upper3 0 DR
R610 VDD N356 100k
J_F204 VDD N356 P302 DR
R611 P302 n204 1k
R612 n204 VSS 4.8k
J_B204 N356 n203 0 DR
R613 VDD N357 100k
J_F205 VDD N357 P303 DR
R614 P303 n205 1k
R615 n205 VSS 4.8k
J_B205 N357 2Lower0 P304 DR
J_A99 P304 2Upper2 0 DR
R616 VDD N358 100k
J_F206 VDD N358 P305 DR
R617 P305 n206 1k
R618 n206 VSS 4.8k
J_B206 N358 n205 0 DR
R619 VDD N359 100k
J_F207 VDD N359 P306 DR
R620 P306 n207 1k
R621 n207 VSS 4.8k
J_B207 N359 n204 P307 DR
J_A100 P307 n206 0 DR
R622 VDD N360 100k
J_F208 VDD N360 P308 DR
R623 P308 DAC 1k
R624 DAC VSS 4.8k
J_B208 N360 n207 0 DR
R625 VDD N361 100k
J_F209 VDD N361 P309 DR
R626 P309 n209 1k
R627 n209 VSS 4.8k
J_B209 N361 Lower3 P310 DR
J_A101 P310 Upper3 0 DR
R628 VDD N362 100k
J_F210 VDD N362 P311 DR
R629 P311 n210 1k
R630 n210 VSS 4.8k
J_B210 N362 n209 0 DR
R631 VDD N363 100k
J_F211 VDD N363 P312 DR
R632 P312 n211 1k
R633 n211 VSS 4.8k
J_B211 N363 2Lower1 P313 DR
J_A102 P313 2Upper2 0 DR
R634 VDD N364 100k
J_F212 VDD N364 P314 DR
R635 P314 n212 1k
R636 n212 VSS 4.8k
J_B212 N364 n211 0 DR
R637 VDD N365 100k
J_F213 VDD N365 P315 DR
R638 P315 n213 1k
R639 n213 VSS 4.8k
J_B213 N365 n210 P316 DR
J_A103 P316 n212 0 DR
R640 VDD N366 100k
J_F214 VDD N366 P317 DR
R641 P317 TCS 1k
R642 TCS VSS 4.8k
J_B214 N366 n213 0 DR
R643 VDD N367 100k
J_F215 VDD N367 P318 DR
R644 P318 n215 1k
R645 n215 VSS 4.8k
J_B215 N367 Lower3 P319 DR
J_A104 P319 Upper3 0 DR
R646 VDD N368 100k
J_F216 VDD N368 P320 DR
R647 P320 n216 1k
R648 n216 VSS 4.8k
J_B216 N368 n215 0 DR
R649 VDD N369 100k
J_F217 VDD N369 P321 DR
R650 P321 n217 1k
R651 n217 VSS 4.8k
J_B217 N369 2Lower2 P322 DR
J_A105 P322 2Upper2 0 DR
R652 VDD N370 100k
J_F218 VDD N370 P323 DR
R653 P323 n218 1k
R654 n218 VSS 4.8k
J_B218 N370 n217 0 DR
R655 VDD N371 100k
J_F219 VDD N371 P324 DR
R656 P324 n219 1k
R657 n219 VSS 4.8k
J_B219 N371 n216 P325 DR
J_A106 P325 n218 0 DR
R658 VDD N372 100k
J_F220 VDD N372 P326 DR
R659 P326 STC 1k
R660 STC VSS 4.8k
J_B220 N372 n219 0 DR
R661 VDD N373 100k
J_F221 VDD N373 P327 DR
R662 P327 n221 1k
R663 n221 VSS 4.8k
J_B221 N373 Lower3 P328 DR
J_A107 P328 Upper3 0 DR
R664 VDD N374 100k
J_F222 VDD N374 P329 DR
R665 P329 n222 1k
R666 n222 VSS 4.8k
J_B222 N374 n221 0 DR
R667 VDD N375 100k
J_F223 VDD N375 P330 DR
R668 P330 n223 1k
R669 n223 VSS 4.8k
J_B223 N375 2Lower3 P331 DR
J_A108 P331 2Upper2 0 DR
R670 VDD N376 100k
J_F224 VDD N376 P332 DR
R671 P332 n224 1k
R672 n224 VSS 4.8k
J_B224 N376 n223 0 DR
R673 VDD N377 100k
J_F225 VDD N377 P333 DR
R674 P333 n225 1k
R675 n225 VSS 4.8k
J_B225 N377 n222 P334 DR
J_A109 P334 n224 0 DR
R676 VDD N378 100k
J_F226 VDD N378 P335 DR
R677 P335 DAA 1k
R678 DAA VSS 4.8k
J_B226 N378 n225 0 DR
R679 VDD N379 100k
J_F227 VDD N379 P336 DR
R680 P336 n227 1k
R681 n227 VSS 4.8k
J_B227 N379 Lower3 P337 DR
J_A110 P337 Upper3 0 DR
R682 VDD N380 100k
J_F228 VDD N380 P338 DR
R683 P338 n228 1k
R684 n228 VSS 4.8k
J_B228 N380 n227 0 DR
R685 VDD N381 100k
J_F229 VDD N381 P339 DR
R686 P339 n229 1k
R687 n229 VSS 4.8k
J_B229 N381 2Lower0 P340 DR
J_A111 P340 2Upper3 0 DR
R688 VDD N382 100k
J_F230 VDD N382 P341 DR
R689 P341 n230 1k
R690 n230 VSS 4.8k
J_B230 N382 n229 0 DR
R691 VDD N383 100k
J_F231 VDD N383 P342 DR
R692 P342 n231 1k
R693 n231 VSS 4.8k
J_B231 N383 n228 P343 DR
J_A112 P343 n230 0 DR
R694 VDD N384 100k
J_F232 VDD N384 P344 DR
R695 P344 KBP 1k
R696 KBP VSS 4.8k
J_B232 N384 n231 0 DR
R697 VDD N385 100k
J_F233 VDD N385 P345 DR
R698 P345 n233 1k
R699 n233 VSS 4.8k
J_B233 N385 Lower3 P346 DR
J_A113 P346 Upper3 0 DR
R700 VDD N386 100k
J_F234 VDD N386 P347 DR
R701 P347 n234 1k
R702 n234 VSS 4.8k
J_B234 N386 n233 0 DR
R703 VDD N387 100k
J_F235 VDD N387 P348 DR
R704 P348 n235 1k
R705 n235 VSS 4.8k
J_B235 N387 2Lower1 P349 DR
J_A114 P349 2Upper3 0 DR
R706 VDD N388 100k
J_F236 VDD N388 P350 DR
R707 P350 n236 1k
R708 n236 VSS 4.8k
J_B236 N388 n235 0 DR
R709 VDD N389 100k
J_F237 VDD N389 P351 DR
R710 P351 n237 1k
R711 n237 VSS 4.8k
J_B237 N389 n234 P352 DR
J_A115 P352 n236 0 DR
R712 VDD N390 100k
J_F238 VDD N390 P353 DR
R713 P353 DCL 1k
R714 DCL VSS 4.8k
J_B238 N390 n237 0 DR
R715 VDD N391 100k
J_F239 VDD N391 P354 DR
R716 P354 n239 1k
R717 n239 VSS 4.8k
J_B239 N391 WR1 0 DR
J_B240 N391 WR0 0 DR
R718 VDD N392 100k
J_F240 VDD N392 P355 DR
R719 P355 n240 1k
R720 n240 VSS 4.8k
J_B241 N392 n239 0 DR
R721 VDD N393 100k
J_F241 VDD N393 P356 DR
R722 P356 n241 1k
R723 n241 VSS 4.8k
J_B242 N393 WR3 0 DR
J_B243 N393 WR2 0 DR
R724 VDD N394 100k
J_F242 VDD N394 P357 DR
R725 P357 n242 1k
R726 n242 VSS 4.8k
J_B244 N394 n241 0 DR
R727 VDD N395 100k
J_F243 VDD N395 P358 DR
R728 P358 n243 1k
R729 n243 VSS 4.8k
J_B245 N395 n242 0 DR
J_B246 N395 n240 0 DR
R730 VDD N396 100k
J_F244 VDD N396 P359 DR
R731 P359 WR 1k
R732 WR VSS 4.8k
J_B247 N396 n243 0 DR
R733 VDD N397 100k
J_F245 VDD N397 P360 DR
R734 P360 n245 1k
R735 n245 VSS 4.8k
J_B248 N397 RD1 0 DR
J_B249 N397 RD0 0 DR
R736 VDD N398 100k
J_F246 VDD N398 P361 DR
R737 P361 n246 1k
R738 n246 VSS 4.8k
J_B250 N398 n245 0 DR
R739 VDD N399 100k
J_F247 VDD N399 P362 DR
R740 P362 n247 1k
R741 n247 VSS 4.8k
J_B251 N399 RD3 0 DR
J_B252 N399 RD2 0 DR
R742 VDD N400 100k
J_F248 VDD N400 P363 DR
R743 P363 n248 1k
R744 n248 VSS 4.8k
J_B253 N400 n247 0 DR
R745 VDD N401 100k
J_F249 VDD N401 P364 DR
R746 P364 n249 1k
R747 n249 VSS 4.8k
J_B254 N401 n248 0 DR
J_B255 N401 n246 0 DR
R748 VDD N402 100k
J_F250 VDD N402 P365 DR
R749 P365 RD 1k
R750 RD VSS 4.8k
J_B256 N402 n249 0 DR
R751 VDD N403 100k
J_F251 VDD N403 P366 DR
R752 P366 n251 1k
R753 n251 VSS 4.8k
J_B257 N403 JUN 0 DR
J_B258 N403 JCN 0 DR
R754 VDD N404 100k
J_F252 VDD N404 P367 DR
R755 P367 n252 1k
R756 n252 VSS 4.8k
J_B259 N404 n251 0 DR
R757 VDD N405 100k
J_F253 VDD N405 P368 DR
R758 P368 n253 1k
R759 n253 VSS 4.8k
J_B260 N405 ISZ 0 DR
J_B261 N405 JMS 0 DR
R760 VDD N406 100k
J_F254 VDD N406 P369 DR
R761 P369 n254 1k
R762 n254 VSS 4.8k
J_B262 N406 n253 0 DR
R763 VDD N407 100k
J_F255 VDD N407 P370 DR
R764 P370 n255 1k
R765 n255 VSS 4.8k
J_B263 N407 n254 0 DR
J_B264 N407 n252 0 DR
R766 VDD N408 100k
J_F256 VDD N408 P371 DR
R767 P371 2Word 1k
R768 2Word VSS 4.8k
J_B265 N408 n255 0 DR
R769 VDD N409 100k
J_F257 VDD N409 P372 DR
R770 P372 n257 1k
R771 n257 VSS 4.8k
J_B266 N409 JUN 0 DR
J_B267 N409 JCN 0 DR
R772 VDD N410 100k
J_F258 VDD N410 P373 DR
R773 P373 n258 1k
R774 n258 VSS 4.8k
J_B268 N410 n257 0 DR
R775 VDD N411 100k
J_F259 VDD N411 P374 DR
R776 P374 n259 1k
R777 n259 VSS 4.8k
J_B269 N411 ISZ 0 DR
J_B270 N411 JMS 0 DR
R778 VDD N412 100k
J_F260 VDD N412 P375 DR
R779 P375 n260 1k
R780 n260 VSS 4.8k
J_B271 N412 n259 0 DR
R781 VDD N413 100k
J_F261 VDD N413 P376 DR
R782 P376 n261 1k
R783 n261 VSS 4.8k
J_B272 N413 n260 0 DR
J_B273 N413 n258 0 DR
R784 VDD N414 100k
J_F262 VDD N414 P377 DR
R785 P377 Jump 1k
R786 Jump VSS 4.8k
J_B274 N414 n261 0 DR
R787 VDD N415 100k
J_F263 VDD N415 P378 DR
R788 P378 n263 1k
R789 n263 VSS 4.8k
J_B275 N415 IR2_0 0 DR
R790 VDD N416 100k
J_F264 VDD N416 P379 DR
R791 P379 n264 1k
R792 n264 VSS 4.8k
J_B276 N416 dec_inv_IR1_3 P380 DR
J_A116 P380 dec_inv_IR1_2 0 DR
R793 VDD N417 100k
J_F265 VDD N417 P381 DR
R794 P381 n265 1k
R795 n265 VSS 4.8k
J_B277 N417 n264 0 DR
R796 VDD N418 100k
J_F266 VDD N418 P382 DR
R797 P382 n266 1k
R798 n266 VSS 4.8k
J_B278 N418 IR1_1 P383 DR
J_A117 P383 dec_inv_IR1_0 0 DR
R799 VDD N419 100k
J_F267 VDD N419 P384 DR
R800 P384 n267 1k
R801 n267 VSS 4.8k
J_B279 N419 n266 0 DR
R802 VDD N420 100k
J_F268 VDD N420 P385 DR
R803 P385 n268 1k
R804 n268 VSS 4.8k
J_B280 N420 n265 P386 DR
J_A118 P386 n267 0 DR
R805 VDD N421 100k
J_F269 VDD N421 P387 DR
R806 P387 n269 1k
R807 n269 VSS 4.8k
J_B281 N421 n268 0 DR
R808 VDD N422 100k
J_F270 VDD N422 P388 DR
R809 P388 n270 1k
R810 n270 VSS 4.8k
J_B282 N422 IR1_1 P389 DR
J_A119 P389 IR1_0 0 DR
R811 VDD N423 100k
J_F271 VDD N423 P390 DR
R812 P390 n271 1k
R813 n271 VSS 4.8k
J_B283 N423 n270 0 DR
R814 VDD N424 100k
J_F272 VDD N424 P391 DR
R815 P391 n272 1k
R816 n272 VSS 4.8k
J_B284 N424 n265 P392 DR
J_A120 P392 n271 0 DR
R817 VDD N425 100k
J_F273 VDD N425 P393 DR
R818 P393 n273 1k
R819 n273 VSS 4.8k
J_B285 N425 n272 0 DR
R820 VDD N426 100k
J_F274 VDD N426 P394 DR
R821 P394 n274 1k
R822 n274 VSS 4.8k
J_B286 N426 n269 P395 DR
J_A121 P395 n263 0 DR
R823 VDD N427 100k
J_F275 VDD N427 P396 DR
R824 P396 FIM 1k
R825 FIM VSS 4.8k
J_B287 N427 n274 0 DR
R826 VDD N428 100k
J_F276 VDD N428 P397 DR
R827 P397 n276 1k
R828 n276 VSS 4.8k
J_B288 N428 n269 P398 DR
J_A122 P398 IR2_0 0 DR
R829 VDD N429 100k
J_F277 VDD N429 P399 DR
R830 P399 SRC 1k
R831 SRC VSS 4.8k
J_B289 N429 n276 0 DR
R832 VDD N430 100k
J_F278 VDD N430 P400 DR
R833 P400 n278 1k
R834 n278 VSS 4.8k
J_B290 N430 n273 P401 DR
J_A123 P401 n263 0 DR
R835 VDD N431 100k
J_F279 VDD N431 P402 DR
R836 P402 FIN 1k
R837 FIN VSS 4.8k
J_B291 N431 n278 0 DR
R838 VDD N432 100k
J_F280 VDD N432 P403 DR
R839 P403 n280 1k
R840 n280 VSS 4.8k
J_B292 N432 n273 P404 DR
J_A124 P404 IR2_0 0 DR
R841 VDD N433 100k
J_F281 VDD N433 P405 DR
R842 P405 JIN 1k
R843 JIN VSS 4.8k
J_B293 N433 n280 0 DR
R844 VDD N434 100k
J_F282 VDD N434 P406 DR
R845 P406 n282 1k
R846 n282 VSS 4.8k
J_B294 N434 FIM 0 DR
J_B295 N434 2Word 0 DR
R847 VDD N435 100k
J_F283 VDD N435 P407 DR
R848 P407 2Word 1k
R849 2Word VSS 4.8k
J_B296 N435 n282 0 DR
R850 VDD N436 100k
J_F284 VDD N436 P408 DR
R851 P408 n284 1k
R852 n284 VSS 4.8k
J_B297 N436 JIN 0 DR
J_B298 N436 Jump 0 DR
R853 VDD N437 100k
J_F285 VDD N437 P409 DR
R854 P409 Jump 1k
R855 Jump VSS 4.8k
J_B299 N437 n284 0 DR
.model NJF NJF
.model PJF PJF
.lib standard.jft
.backanno
.end